# Altium schematic sheet ESP8266.SchDoc
size A4
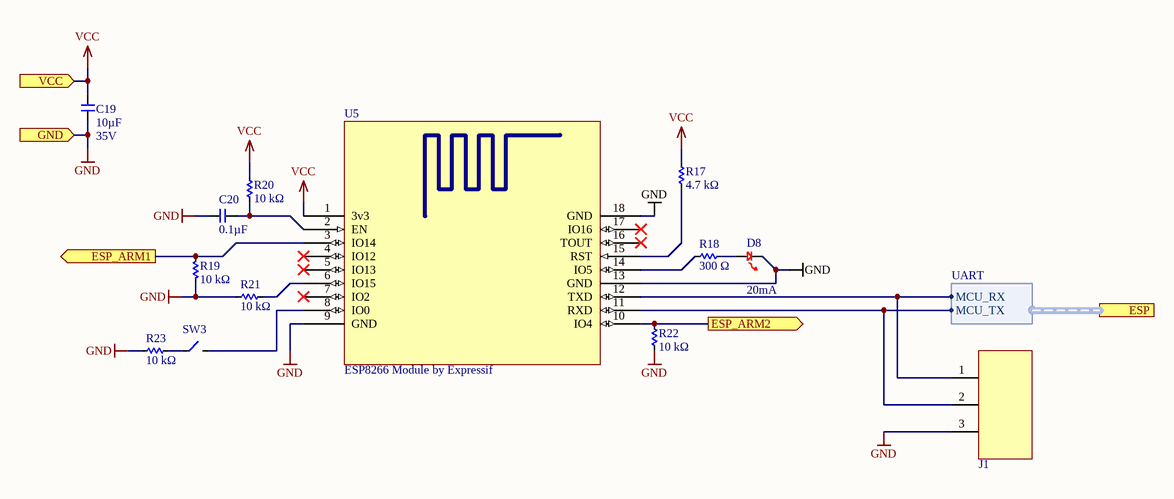
[diagram p0: ESP8266.SchDoc]

## Parts
C19  Capacitance (shorthand): 10µF  Rated Voltage: 35V  [C0603]  (hidden comment: __template_cap)
C20  Capacitance (shorthand): 0.1µF  [C0603]  (hidden comment: __template_cap)
D8  Current - Test: 20mA  [0805_Diode]  (hidden comment: RED)
J1  CONN_1x3_RA_SMT_MALE_TSM-103-01-L-SH  [CONN_1x3_100MIL_RA_SMT]  (value not drawn)
R17  Resistance: 4.7 kΩ  [R0603]  (hidden comment: __template_resistor)
R18  Resistance: 300 Ω  [R0603]  (hidden comment: __template_resistor)
R19  Resistance: 10 kΩ  [R0603]  (hidden comment: __template_resistor)
R20  Resistance: 10 kΩ  [R0603]  (hidden comment: __template_resistor)
R21  Resistance: 10 kΩ  [R0603]  (hidden comment: __template_resistor)
R22  Resistance: 10 kΩ  [R0603]  (hidden comment: __template_resistor)
R23  Resistance: 10 kΩ  [R0603]  (hidden comment: __template_resistor)
SW3  SWITCH_SPST-NO  [SWITCH_B3U-1000P]  (value not drawn)
U5  ESP8266 Module by Expressif  [ESP-WROOM-02]

## Ports
ESP (harness UART), ESP_ARM1 (out), ESP_ARM2 (out), GND (in), VCC (in)

## Harnesses
UART: MCU_RX, MCU_TX

## Nets
GND: C19.2 C20.1 D8.1 J1.3 R19.2 R21.2 R22.2 R23.2 U5.9(GND) U5.13(GND) U5.18(GND) ; port GND
VCC: C19.1 R17.2 R20.2 U5.1(3v3) ; port VCC
ESP_ARM1: R19.1 U5.3(IO14) ; port ESP_ARM1
ESP_ARM2: R22.1 U5.10(IO4) ; port ESP_ARM2
NetC20_2: C20.2 R20.1 U5.2(EN)
NetD8_2: D8.2 R18.2
NetJ1_1: J1.1 U5.12(TXD) ; port ESP.MCU_RX
NetJ1_2: J1.2 U5.11(RXD) ; port ESP.MCU_TX
NetR17_1: R17.1 U5.15(RST)
NetR18_1: R18.1 U5.14(IO5)
NetR21_1: R21.1 U5.6(IO15)
NetR23_1: R23.1 SW3.1
NetSW3_2: SW3.2 U5.8(IO0)

Not connected (* = marked no-connect by the designer): U5 4(IO12)* 5(IO13)* 7(IO2)* 16(TOUT)* 17(IO16)*

## Notes on the sheet
- Title
- Size:
- Date:
- A4
- Number:
- Time:
- Revision:
- Sheet
- of
- File:

## Library data of the parts
C19 = CAP CER 10UF 35V X5R 0603 20%: Manufacturer: Murata Electronics North America; Capacitance - pF (Machine readable): 10000000; type: capacitor; Dielectric: X5R; Description: CAP CER 10UF 35V X5R 0603 20%; Supplier 1: Digikey; Supplier Part Number 1: 490-13248-1-ND
C20 = CAP CER 0603 0.1µF X7R 50V 10%: Manufacturer: Murata Electronics North America; Rated Voltage: 50V; Capacitance - pF (Machine readable): 100000; type: capacitor; Dielectric: X7R; Supplier 1: Digikey; Supplier Part Number 1: 490-1519-1-ND
D8 = LED_LY974: LED 0805 RED 20MA; Manufacturer: OSRAM Opto Semiconductors Inc; Manufacturer Part Number: LH R974-LP-1; Wavelength - Dominant: 645nm; Wavelength - Peak: 660nm; Millicandela Rating: 41mcd; Voltage - Forward (Vf) (Typ): 1.8V; Viewing Angle: 160°; Lens Transparency: Diffused; Lens Color: White; Lens Style/Size: Rectangle with Flat Top, 1.30mm x 1.25mm; Supplier 1: Digi-Key; RoHS: RoHS Compliant; Category: Optoelectronics; Stock 1: 66379; Pricing 1: 1=0.08, 10=0.07, 100=0.0559, 250=0.04892, 500=0.04472 (USD); Packaging: Cut Tape (CT); Color: Red; Package / Case: 0805 (2012 Metric); Supplier Device Package: *; Size / Dimension: 2.00mm L x 1.25mm W; Height (Max): 0.80mm; Mounting Type: Surface Mount; ComponentLink1URL: http://www.osram-os.com/Graphics/XPic8/00078869_0.pdf; ComponentLink1Description: http://www.osram-os.com/Graphics/XPic8/00078869_0.pdf; Supplier Part Number 1: 475-1415-1-ND
J1 = CONN_1x3_RA_SMT_MALE_TSM-103-01-L-SH: CONN HEADER 3POS .100" SNGL SMD; Manufacturer: Samtec Inc.; Pitch - Mating: 0.100" (2.54mm); Style: Board to Board or Cable; Shrouding: Unshrouded; Number of Positions: 3; Number of Positions Loaded: All; Contact Length - Mating: 0.230" (5.84mm); Material Flammability Rating: UL94 V-0; Supplier 1: Digi-Key; Manufacturer Part Number: TSM-103-01-L-SH; RoHS: RoHS Compliant; Category: Connectors, Interconnects; Stock 1: 1775; Pricing 1: 1=0.56, 10=0.525, 100=0.4025, 500=0.35, 1000=0.28875, 5000=0.25375, 10000=0.23625 (USD); Packaging: Tube; Part Status: Active; Connector Type: Header; Contact Type: Male Pin; Number of Rows: 1; Row Spacing - Mating: -; Mounting Type: Surface Mount, Right Angle; Termination: Solder; Fastening Type: -; Contact Length - Post: -; Overall Contact Length: -; Insulation Height: 0.120" (3.05mm); Contact Shape: Square; Contact Finish - Mating: Gold; Contact Finish Thickness - Mating: 10µin (0.25µm); Contact Finish - Post: Tin; Contact Material: Phosphor Bronze; Insulation Material: Liquid Crystal Polymer (LCP); Features: -; Operating Temperature: -55°C ~ 125°C; Ingress Protection: -; Insulation Color: Black; Current Rating: -; Voltage Rating: -; Mated Stacking Heights: -; Contact Finish Thickness - Post: -; Applications: -; ComponentLink1URL: http://suddendocs.samtec.com/prints/tsm-1xx-xx-xxx-xx-x-xxx-x-mkt.pdf; ComponentLink1Description: http://suddendocs.samtec.com/prints/tsm-1xx-xx-xxx-xx-x-xxx-x-mkt.pdf; Supplier Part Number 1: SAM10270-ND
R17 = RES SMD 4.7K OHM 1% 1/10W 0603: Manufacturer: Yageo; Manufacturer Part Number: RC0603FR-074K7L; Resistance (Sortable): 4700; Tolerance: ±1%; Power (Watts): 0.1W, 1/10W; Temperature Coefficient: ±100ppm/°C; Supplier 1: Digikey; Supplier Part Number 1: 311-4.70KHRCT-ND; Datasheets: http://www.yageo.com/documents/recent/PYu-RC_Group_51_RoHS_L_9.pdf; Image: //media.digikey.com/Renders/Yageo%20Renders/0603-(1608-Metric).jpg; Operating Temperature: -55°C ~ 155°C
R18 = RES SMD 300 OHM 1% 1/10W 0603: Manufacturer: Yageo; Manufacturer Part Number: RC0603FR-07300RL; Resistance (Sortable): 300; Tolerance: ±1%; Power (Watts): 0.1W, 1/10W; Temperature Coefficient: ±100ppm/°C; Supplier 1: Digikey; Supplier Part Number 1: 311-300HRCT-ND; Datasheets: http://www.yageo.com/documents/recent/PYu-RC_Group_51_RoHS_L_9.pdf; Image: //media.digikey.com/Renders/Yageo%20Renders/0603-(1608-Metric).jpg; Operating Temperature: -55°C ~ 155°C
R19-R23 = RES SMD 10K OHM 1% 1/10W 0603: Manufacturer: Yageo; Manufacturer Part Number: RC0603FR-0710KL; Resistance (Sortable): 10000; Tolerance: ±1%; Power (Watts): 0.1W, 1/10W; Temperature Coefficient: ±100ppm/°C; Supplier 1: Digikey; Supplier Part Number 1: 311-10.0KHRCT-ND; Datasheets: http://www.yageo.com/documents/recent/PYu-RC_Group_51_RoHS_L_9.pdf; Image: //media.digikey.com/Renders/Yageo%20Renders/0603-(1608-Metric).jpg; Operating Temperature: -55°C ~ 155°C
SW3 = SWITCH_SPST-NO: SWITCH TACTILE SPST-NO 0.05A 12V; Manufacturer: Omron Electronics Inc-EMC Div; Manufacturer Part Number: B3U-1000P; Switch Function: Off-Mom; Actuator Type: Standard; Actuator Height off PCB, from Pins: 1.60mm; Actuator Orientation: Top Actuated; Outline: 3.00mm x 2.50mm; Illumination: Non-Illuminated; Operating Force: 153gf; Ingress Protection: Dust Proof; Switch Travel: 0.15mm; Mechanical Life: 200,000 Cycles; Contact Rating @ Voltage: 0.05A @ 12VDC; Supplier 1: Digi-Key; RoHS: RoHS Compliant; Category: Switches; Stock 1: 16437; Pricing 1: 1=1.25, 10=1.201, 25=1.1332, 50=0.997, 100=0.9064, 250=0.86108, 500=0.83842, 1000=0.65714 (USD); Circuit: SPST-NO; Mounting Type: Surface Mount; Termination Style: SMD (SMT) Tab; Illumination Voltage (Nominal): -; Illumination Type, Color: -; Features: -; Packaging: Cut Tape (CT); Actuator Material: -; Operating Temperature: -25°C ~ 70°C; ComponentLink1URL: http://components.omron.com/components/web/pdflib.nsf/0/2DD3893C7DD33E9E862572900079E9D6/$file/B3U_1110.pdf; ComponentLink1Description: http://components.omron.com/components/web/pdflib.nsf/0/2DD3893C7DD33E9E862572900079E9D6/$file/B3U_1110.pdf; Supplier Part Number 1: SW1020CT-ND
U5 = ESP-WROOM-02: IC: ESP8266-EX; Vendor: Expressif Systems; LatestReviewer: Tim Vrakas; Published: 14-Apr-2015; Publisher: SSI; LatestRevisionData: 12/20/2017; LatestRevisionNote: WROOM Module